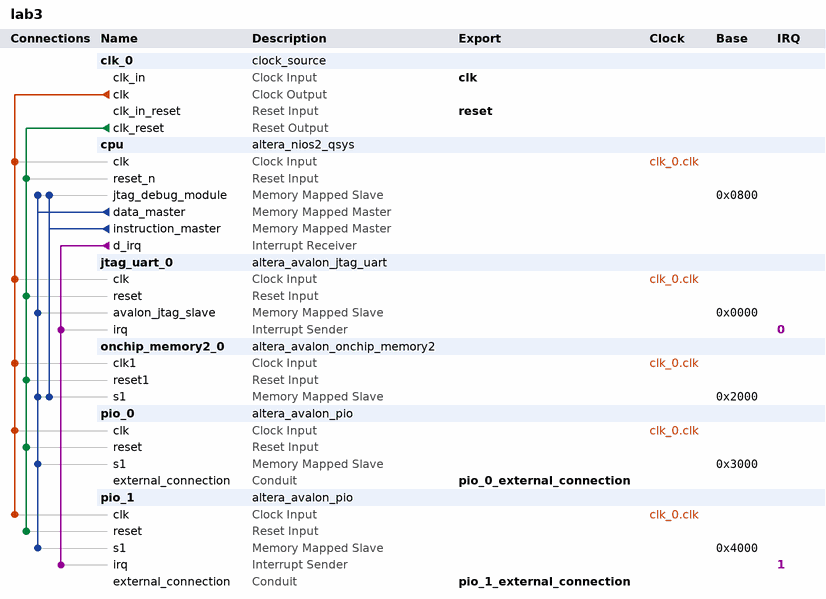
[diagram p0: system contents]
# Platform Designer (Qsys) system lab3, Cyclone II EP2C5T144C8
# Parameters at their usual value, and those the tool derives, are not listed.
package require -exact qsys 13.0.1.99.2
create_system lab3
set_project_property DEVICE_FAMILY {Cyclone II}
set_project_property DEVICE EP2C5T144C8

add_instance clk_0 clock_source 13.0
set_instance_parameter_value clk_0 clockFrequency 50000000

add_instance cpu altera_nios2_qsys 13.0
set_instance_parameter_value cpu resetSlave onchip_memory2_0.s1
set_instance_parameter_value cpu mmu_TLBMissExcSlave None
set_instance_parameter_value cpu exceptionSlave onchip_memory2_0.s1
set_instance_parameter_value cpu breakSlave cpu.jtag_debug_module
set_instance_parameter_value cpu impl Tiny
set_instance_parameter_value cpu icache_size 4096

add_instance jtag_uart_0 altera_avalon_jtag_uart 13.0.1.99.2
set_instance_parameter_value jtag_uart_0 simInteractiveOptions NO_INTERACTIVE_WINDOWS

add_instance onchip_memory2_0 altera_avalon_onchip_memory2 13.0.1.99.2
set_instance_parameter_value onchip_memory2_0 dataWidth 32
set_instance_parameter_value onchip_memory2_0 dualPort false
set_instance_parameter_value onchip_memory2_0 initMemContent true
set_instance_parameter_value onchip_memory2_0 initializationFileName onchip_mem.hex
set_instance_parameter_value onchip_memory2_0 memorySize 4096

add_instance pio_0 altera_avalon_pio 13.0.1.99.2
set_instance_parameter_value pio_0 direction Output
set_instance_parameter_value pio_0 width 3

add_instance pio_1 altera_avalon_pio 13.0.1.99.2
set_instance_parameter_value pio_1 captureEdge true
set_instance_parameter_value pio_1 direction Input
set_instance_parameter_value pio_1 generateIRQ true
set_instance_parameter_value pio_1 irqType EDGE
set_instance_parameter_value pio_1 width 2

# connections
add_connection clk_0.clk cpu.clk clock
add_connection clk_0.clk jtag_uart_0.clk clock
add_connection clk_0.clk onchip_memory2_0.clk1 clock
add_connection clk_0.clk pio_0.clk clock
add_connection clk_0.clk pio_1.clk clock
add_connection clk_0.clk_reset cpu.reset_n reset
add_connection clk_0.clk_reset jtag_uart_0.reset reset
add_connection clk_0.clk_reset onchip_memory2_0.reset1 reset
add_connection clk_0.clk_reset pio_0.reset reset
add_connection clk_0.clk_reset pio_1.reset reset
add_connection cpu.data_master cpu.jtag_debug_module avalon
set_connection_parameter_value cpu.data_master/cpu.jtag_debug_module baseAddress 0x0800
add_connection cpu.data_master jtag_uart_0.avalon_jtag_slave avalon
set_connection_parameter_value cpu.data_master/jtag_uart_0.avalon_jtag_slave baseAddress 0x0000
add_connection cpu.data_master onchip_memory2_0.s1 avalon
set_connection_parameter_value cpu.data_master/onchip_memory2_0.s1 baseAddress 0x2000
add_connection cpu.data_master pio_0.s1 avalon
set_connection_parameter_value cpu.data_master/pio_0.s1 baseAddress 0x3000
add_connection cpu.data_master pio_1.s1 avalon
set_connection_parameter_value cpu.data_master/pio_1.s1 baseAddress 0x4000
add_connection cpu.instruction_master cpu.jtag_debug_module avalon
set_connection_parameter_value cpu.instruction_master/cpu.jtag_debug_module baseAddress 0x0800
add_connection cpu.instruction_master onchip_memory2_0.s1 avalon
set_connection_parameter_value cpu.instruction_master/onchip_memory2_0.s1 baseAddress 0x2000
add_connection cpu.d_irq jtag_uart_0.irq interrupt
set_connection_parameter_value cpu.d_irq/jtag_uart_0.irq irqNumber 0
add_connection cpu.d_irq pio_1.irq interrupt
set_connection_parameter_value cpu.d_irq/pio_1.irq irqNumber 1

# exported interfaces
add_interface clk clock sink
set_interface_property clk EXPORT_OF clk_0.clk_in
add_interface reset reset sink
set_interface_property reset EXPORT_OF clk_0.clk_in_reset
add_interface pio_0_external_connection conduit end
set_interface_property pio_0_external_connection EXPORT_OF pio_0.external_connection
add_interface pio_1_external_connection conduit end
set_interface_property pio_1_external_connection EXPORT_OF pio_1.external_connection

set_interconnect_requirement {$system} qsys_mm.clockCrossingAdapter HANDSHAKE
set_interconnect_requirement {$system} qsys_mm.maxAdditionalLatency 1

save_system lab3.qsys
